# Altium project Microphone_Module.PrjPcb
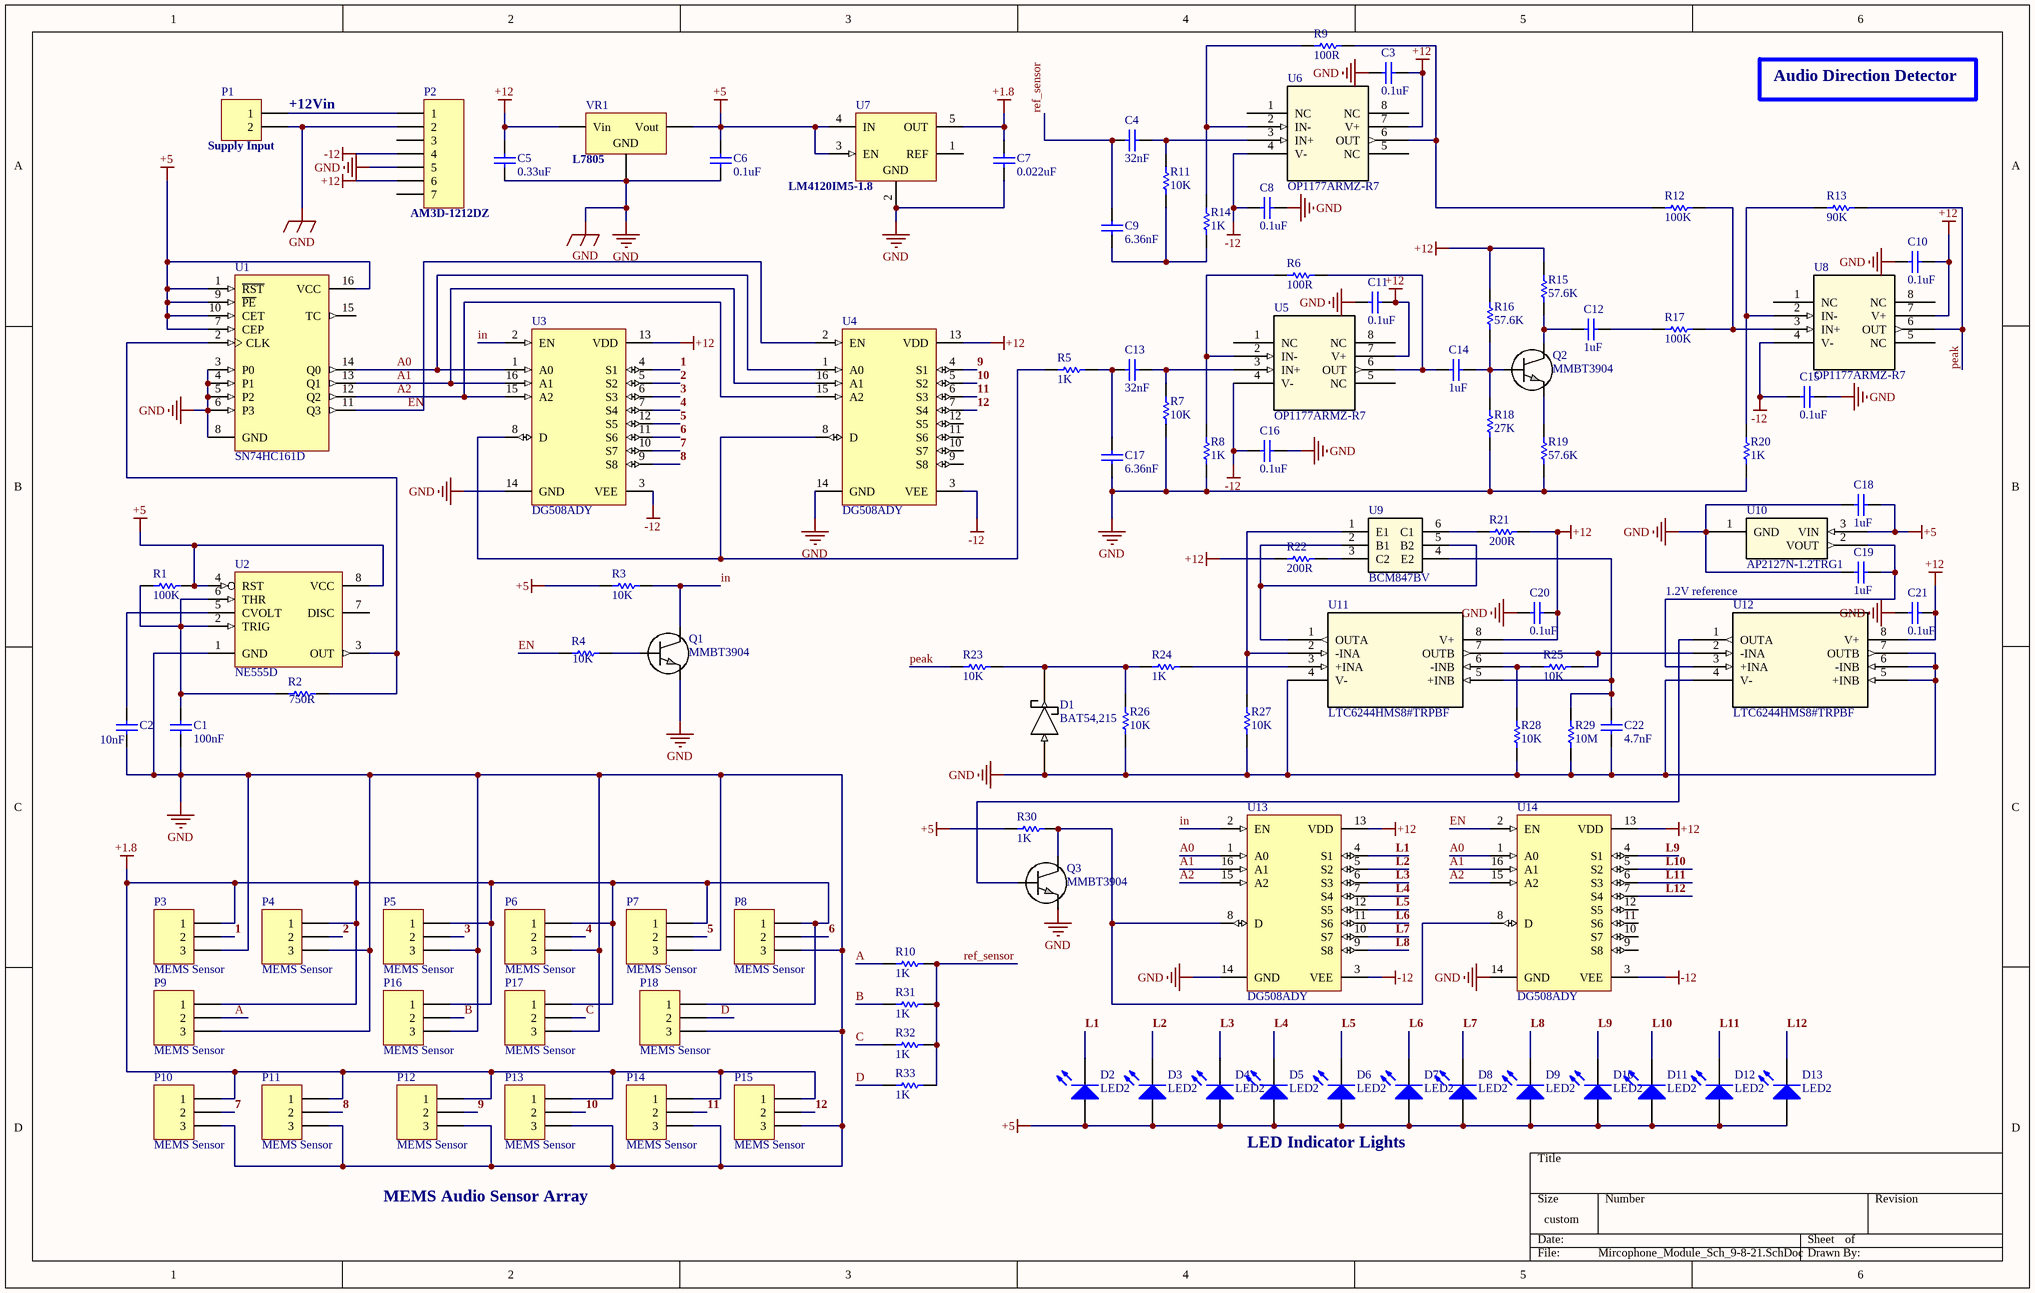
[diagram p0: Mircophone_Module_Sch_9-8-21.SchDoc]
1 sheet, 104 parts. Net scope: global (net labels, ports and power ports of the same name join across sheets).
Board file: Microphone_Module_PCB_14-8-21.PcbDoc

## Sheet Mircophone_Module_Sch_9-8-21.SchDoc
size 381 x 241 mm

### Parts
C1  100nF  [C1206]
C2  10nF  [C1206]
C3  0.1uF  [C1206]
C4  32nF  [C1206]
C5  0.33uF  [C1206]
C6  0.1uF  [C1206]
C7  0.022uF  [C1206]
C8  0.1uF  [C1206]
C9  6.36nF  [C1206]
C10  0.1uF  [C1206]
C11  0.1uF  [C1206]
C12  1uF  [C1206]
C13  32nF  [C1206]
C14  1uF  [C1206]
C15  0.1uF  [C1206]
C16  0.1uF  [C1206]
C17  6.36nF  [C1206]
C18  1uF  [C1206]
C19  1uF  [C1206]
C20  0.1uF  [C1206]
C21  0.1uF  [C1206]
C22  4.7nF  [C1206]
D1  BAT54,215  [SOT95P230X110-3N]
D2  LED2  [0603]
D3  LED2  [0603]
D4  LED2  [0603]
D5  LED2  [0603]
D6  LED2  [0603]
D7  LED2  [0603]
D8  LED2  [0603]
D9  LED2  [0603]
D10  LED2  [0603]
D11  LED2  [0603]
D12  LED2  [0603]
D13  LED2  [0603]
P1  Supply Input  [HDR1X2]
P2  AM3D-1212DZ  [HDR1X7]
P3  MEMS Sensor  [MIC_ICS-43434]
P4  MEMS Sensor  [MIC_ICS-43434]
P5  MEMS Sensor  [MIC_ICS-43434]
P6  MEMS Sensor  [MIC_ICS-43434]
P7  MEMS Sensor  [MIC_ICS-43434]
P8  MEMS Sensor  [MIC_ICS-43434]
P9  MEMS Sensor  [MIC_ICS-43434]
P10  MEMS Sensor  [MIC_ICS-43434]
P11  MEMS Sensor  [MIC_ICS-43434]
P12  MEMS Sensor  [MIC_ICS-43434]
P13  MEMS Sensor  [MIC_ICS-43434]
P14  MEMS Sensor  [MIC_ICS-43434]
P15  MEMS Sensor  [MIC_ICS-43434]
P16  MEMS Sensor  [MIC_ICS-43434]
P17  MEMS Sensor  [MIC_ICS-43434]
P18  MEMS Sensor  [MIC_ICS-43434]
Q1  MMBT3904  [SOT95P230X110-3N]
Q2  MMBT3904  [SOT95P230X110-3N]
Q3  MMBT3904  [SOT95P230X110-3N]
R1  100K  [6-0805_N]
R2  750R  [6-0805_N]
R3  10K  [6-0805_N]
R4  10K  [6-0805_N]
R5  1K  [6-0805_N]
R6  100R  [6-0805_N]
R7  10K  [6-0805_N]
R8  1K  [6-0805_N]
R9  100R  [6-0805_N]
R10  1K  [6-0805_N]
R11  10K  [6-0805_N]
R12  100K  [6-0805_N]
R13  90K  [6-0805_N]
R14  1K  [6-0805_N]
R15  57.6K  [6-0805_N]
R16  57.6K  [6-0805_N]
R17  100K  [6-0805_N]
R18  27K  [6-0805_N]
R19  57.6K  [6-0805_N]
R20  1K  [6-0805_N]
R21  200R  [6-0805_N]
R22  200R  [6-0805_N]
R23  10K  [6-0805_N]
R24  1K  [6-0805_N]
R25  10K  [6-0805_N]
R26  10K  [6-0805_N]
R27  10K  [6-0805_N]
R28  10K  [6-0805_N]
R29  10M  [6-0805_N]
R30  1K  [6-0805_N]
R31  1K  [6-0805_N]
R32  1K  [6-0805_N]
R33  1K  [6-0805_N]
U1  SN74HC161D  [SOIC127P600X175-16N]
U2  NE555D  [SOIC127P599X175-8N]
U3  DG508ADY  [SOIC127P600X175-16N]
U4  DG508ADY  [SOIC127P600X175-16N]
U5  OP1177ARMZ-R7  [SOP65P490X110-8N]
U6  OP1177ARMZ-R7  [SOP65P490X110-8N]
U7  LM4120IM5-1.8  [SOT95P285X120-5N]
U8  OP1177ARMZ-R7  [SOP65P490X110-8N]
U9  BCM847BV  [SOT50P160X60-6N]
U10  AP2127N-1.2TRG1  [SOT91P240X110-3N]
U11  LTC6244HMS8#TRPBF  [MSOP-8_MS]
U12  LTC6244HMS8#TRPBF  [MSOP-8_MS]
U13  DG508ADY  [SOIC127P600X175-16N]
U14  DG508ADY  [SOIC127P600X175-16N]
VR1  L7805  [D2PAK_N]

### Nets
+1.8: C7.2 P3.1 P4.1 P5.1 P6.1 P7.1 P8.1 P9.1 P10.1 P11.1 P12.1 P13.1 P14.1 P15.1 P16.1 P17.1 P18.1 U7.5(OUT)
+5: C6.2 C18.2 D2.1(A) D3.1(A) D4.1(A) D5.1(A) D6.1(A) D7.1(A) D8.1(A) D9.1(A) D10.1(A) D11.1(A) D12.1(A) D13.1(A) R1.2 R3.2 R30.1 U1.1(~{RST}) U1.7(CEP) U1.9(~{PE}) U1.10(CET) U1.16(VCC) U2.4(RST) U2.8(VCC) U7.3(EN) U7.4(IN) U10.3(VIN) VR1.3(Vout)
+12: C3.2 C5.2 C10.2 C11.2 C20.1 C21.1 P2.6 R15.1 R16.1 R21.2 R22.1 U3.13(VDD) U4.13(VDD) U5.7(V+) U6.7(V+) U8.7(V+) U11.8(V+) U12.8(V+) U13.13(VDD) U14.13(VDD) VR1.1(Vin)
-12: C8.2 C15.1 C16.2 P2.4 U3.3(VEE) U4.3(VEE) U5.4(V-) U6.4(V-) U8.4(V-) U13.3(VEE) U14.3(VEE)
GND: C1.1 C2.1 C3.1 C5.1 C6.1 C7.1 C8.1 C10.1 C11.1 C15.2 C16.1 C17.1 C18.1 C19.1 C20.2 C21.2 C22.2 D1.1(ANODE) P1.2 P2.2 P2.5 P3.3 P4.3 P5.3 P6.3 P7.3 P8.3 P9.3 P10.3 P11.3 P12.3 P13.3 P14.3 P15.3 P16.3 P17.3 P18.3 Q1.2 Q3.2 R7.2 R8.2 R18.2 R19.2 R20.2 R26.1 R27.1 R28.2 R29.2 U1.3(P0) U1.4(P1) U1.5(P2) U1.6(P3) U1.8(GND) U2.1(GND) U3.14(GND) U4.14(GND) U7.2(GND) U10.1(GND) U11.4(V-) U12.4(V-) U12.5(+INB) U12.6(-INB) U12.7(OUTB) U13.14(GND) U14.14(GND) VR1.2(GND)
1: P3.2 U3.4(S1)
2: P4.2 U3.5(S2)
3: P5.2 U3.6(S3)
4: P6.2 U3.7(S4)
5: P7.2 U3.12(S5)
6: P8.2 U3.11(S6)
7: P10.2 U3.10(S7)
8: P11.2 U3.9(S8)
9: P12.2 U4.4(S1)
10: P13.2 U4.5(S2)
11: P14.2 U4.6(S3)
12: P15.2 U4.7(S4)
A: P9.2 R10.1
A0: U1.14(Q0) U3.1(A0) U4.1(A0) U13.1(A0) U14.1(A0)
A1: U1.13(Q1) U3.16(A1) U4.16(A1) U13.16(A1) U14.16(A1)
A2: U1.12(Q2) U3.15(A2) U4.15(A2) U13.15(A2) U14.15(A2)
B: P16.2 R31.1
C: P17.2 R32.1
D: P18.2 R33.1
EN: R4.1 U1.11(Q3) U4.2(EN) U14.2(EN)
in: Q1.3 R3.1 U3.2(EN) U13.2(EN)
L1: D2.2(K) U13.4(S1)
L2: D3.2(K) U13.5(S2)
L3: D4.2(K) U13.6(S3)
L4: D5.2(K) U13.7(S4)
L5: D6.2(K) U13.12(S5)
L6: D7.2(K) U13.11(S6)
L7: D8.2(K) U13.10(S7)
L8: D9.2(K) U13.9(S8)
L9: D10.2(K) U14.4(S1)
L10: D11.2(K) U14.5(S2)
L11: D12.2(K) U14.6(S3)
L12: D13.2(K) U14.7(S4)
peak: R13.1 R23.1 U8.6(OUT)
ref_sensor: C4.2 C9.2 R10.2 R31.2 R32.2 R33.2
NetC1_2: C1.2 R1.1 R2.1 U2.2(TRIG) U2.6(THR)
NetC2_2: C2.2 U2.5(CVOLT)
NetC4_1: C4.1 R11.1 U6.3(IN+)
NetC9_1: C9.1 R11.2 R14.2
NetC12_1: C12.1 R17.1
NetC12_2: C12.2 Q2.3 R15.2
NetC13_1: C13.1 R7.1 U5.3(IN+)
NetC13_2: C13.2 C17.2 R5.1
NetC14_1: C14.1 Q2.1 R16.2 R18.1
NetC14_2: C14.2 R6.1 U5.6(OUT)
NetC19_2: C19.2 U10.2(VOUT) U12.3(+INA)
NetC22_1: C22.1 R29.1 U9.4(E2) U11.5(+INB)
NetD1_3: D1.3(CATHODE) R23.2 R24.1 R26.2
NetP1_1: P1.1 P2.1
NetQ1_1: Q1.1 R4.2
NetQ2_2: Q2.2 R19.1
NetQ3_1: Q3.1 U12.1(OUTA)
NetQ3_3: Q3.3 R30.2 U13.8(D) U14.8(D)
NetR2_2: R2.2 U1.2(CLK) U2.3(OUT)
NetR5_2: R5.2 U3.8(D) U4.8(D)
NetR6_2: R6.2 R8.1 U5.2(IN-)
NetR9_1: R9.1 R12.1 U6.6(OUT)
NetR9_2: R9.2 R14.1 U6.2(IN-)
NetR12_2: R12.2 R17.2 U8.3(IN+)
NetR13_2: R13.2 R20.1 U8.2(IN-)
NetR21_1: R21.1 U9.6(C1)
NetR22_2: R22.2 U9.3(C2)
NetR24_2: R24.2 U11.3(+INA)
NetR25_1: R25.1 U11.7(OUTB) U12.2(-INA)
NetR25_2: R25.2 R28.1 U11.6(-INB)
NetR27_2: R27.2 U9.1(E1) U11.2(-INA)
NetU9_2: U9.2(B1) U9.5(B2) U11.1(OUTA)

Not connected (* = marked no-connect by the designer): P2 3 7; U1 15(TC); U2 7(DISC); U4 9(S8) 10(S7) 11(S6) 12(S5); U5 1(NC) 5(NC) 8(NC); U6 1(NC) 5(NC) 8(NC); U7 1(REF); U8 1(NC) 5(NC) 8(NC); U14 9(S8) 10(S7) 11(S6) 12(S5)

### Notes on the sheet
- Audio Direction Detector
- (near P1) +12Vin
- 1.2V reference
- LED Indicator Lights
- MEMS Audio Sensor Array

### Library data of the parts
C1 C3-C6 C8-C11 C13 C15-C17 C20-C22 = Cap Semi: Published: 8-Jun-2000; LatestRevisionDate: 29-May-2009; LatestRevisionNote: IPC-7351 Footprint Added.; PackageReference: C1206; Publisher: Altium Limited; PackageDescription: Chip Capacitor
  C1: Value: 100nF
  C3 C6 C8 C10 C11 C15 C16 C20 C21: Value: 0.1uF
  C4 C13: Value: 32nF
  C5: Value: 0.33uF
  C9 C17: Value: 6.36nF
  C22: Value: 4.7nF
C2 = Cap Semi: Value: 100nF; Published: 8-Jun-2000; LatestRevisionDate: 29-May-2009; LatestRevisionNote: IPC-7351 Footprint Added.; PackageReference: C1206; Publisher: Altium Limited; PackageDescription: Chip Capacitor
C7 = Cap Semi: Value: 0.1uF; Published: 8-Jun-2000; LatestRevisionDate: 29-May-2009; LatestRevisionNote: IPC-7351 Footprint Added.; PackageReference: C1206; Publisher: Altium Limited; PackageDescription: Chip Capacitor
C12 C14 C18 C19 = Cap Semi: Value: 32nF; Published: 8-Jun-2000; LatestRevisionDate: 29-May-2009; LatestRevisionNote: IPC-7351 Footprint Added.; PackageReference: C1206; Publisher: Altium Limited; PackageDescription: Chip Capacitor
D1 = BAT54,215: No Description Available; Mfr_Name: Nexperia; Type: DEV; Copyright: Copyright (C) 2021 Ultra Librarian. All rights reserved.; Manufacturer_Part_Number: BAT54,215; RefDes: RefDes
D2-D13 = LED2: Typical RED, GREEN, YELLOW, AMBER GaAs LED; Published: 8-Jun-2000; LatestRevisionDate: 17-Jul-2002; LatestRevisionNote: Re-released for DXP Platform.; PackageVersion: Feb-2002; PackageReference: 3.2X1.6X1.1; Publisher: Altium Limited; PackageDescription: SM LED; 2 Flat Leads
P1 = Header 2: Header, 2-Pin; LatestRevisionDate: 17-Jul-2002; LatestRevisionNote: Re-released for DXP Platform.; Publisher: Altium Limited
P2 = Header 7: 3 Watt | DC-DC Converter Dual 1000VDC isolation; LatestRevisionDate: 17-Jul-2002; LatestRevisionNote: Re-released for DXP Platform.; Publisher: Altium Limited
P3-P18 = Header 3: MMICT4076-00-908; LatestRevisionDate: 17-Jul-2002; LatestRevisionNote: Re-released for DXP Platform.; Publisher: Altium Limited
Q1-Q3 = MMBT3904: No Description Available; Mfr_Name: Nexperia; Type: DEV; Copyright: Copyright (C) 2021 Ultra Librarian. All rights reserved.; Manufacturer_Part_Number: MMBT3904; RefDes: RefDes
R1-R33 = Res1: Resistor; Published: 8-Jun-2000; LatestRevisionDate: 17-Jul-2002; LatestRevisionNote: Re-released for DXP Platform.; PackageReference: 0805; Publisher: Altium Limited; PackageDescription: 0805
  R1 R12 R17: Value: 100K
  R2: Value: 750R
  R3 R4 R7 R11 R23 R25-R28: Value: 10K
  R5 R8 R10 R14 R20 R24 R30-R33: Value: 1K
  R6 R9: Value: 100R
  R13: Value: 90K
  R15 R16 R19: Value: 57.6K
  R18: Value: 27K
  R21 R22: Value: 200R
  R29: Value: 10M
U1 = SN74HC161D: 4-Bit Synchronous Binary Counter; Published: 8-Jun-2000; LatestRevisionDate: 13-Apr-2006; LatestRevisionNote: IPC-7351 Footprint Added.; DatasheetVersion: May-1997; PackageVersion: Jan-1998; PackageReference: D016; Publisher: Altium Limited; PackageDescription: 16-Pin Small Outline Integrated Circuit 1.27 mm Pitch; Code_IPC: SOIC127P600-16; ComponentLink1Description: Manufacturer Link; ComponentLink1URL: http://www.ti.com/; ComponentLink2Description: Datasheet; ComponentLink2URL: http://www-s.ti.com/sc/ds/sn74hc161.pdf
U2 = NE555D: General-Purpose Single Bipolar Timer; Published: 24-Aug-2001; LatestRevisionDate: 13-Apr-2006; LatestRevisionNote: IPC-7351 Footprint Added.; DatasheetVersion: Jul-1998; PackageVersion: Dec-2002; PackageReference: SO8; Publisher: Altium Limited; PackageDescription: 8-Pin Small Outline Integrated Circuit 1.27 mm Pitch; Code_JEDEC: MS-012-AA; Code_IPC: SOIC127P600-8; ComponentLink1Description: Manufacturer Link; ComponentLink1URL: http://www.st.com/; ComponentLink2Description: Datasheet; ComponentLink2URL: http://www.st.com/stonline/products/literature/ds/2182/ne555.pdf
U3 U4 U13 U14 = DG508ADY: Monolithic CMOS Analog Multiplexer; Published: 16-Jan-2001; LatestRevisionDate: 13-Apr-2006; LatestRevisionNote: IPC-7351 Footprint Added.; DatasheetVersion: Feb-1996; PackageReference: NSO16; Publisher: Altium Limited; PackageDescription: 16-Pin Small Outline Integrated Circuit 1.27 mm Pitch; Code_JEDEC: MS-012-AC; Code_IPC: SOIC127P600-16; ComponentLink1Description: Manufacturer Link; ComponentLink1URL: http://www.maxim-ic.com/; ComponentLink2Description: Datasheet; ComponentLink2URL: http://pdfserv.maxim-ic.com/en/ds/DG508A-DG509A.pdf
U5 U6 U8 = OP1177ARMZ-R7: No Description Available; Mfr_Name: Analog Devices Inc; Copyright: Copyright (C) 2021 Ultra Librarian. All rights reserved.; Manufacturer_Part_Number: OP1177ARMZ-R7; Digi-Key_Part_Number_1: OP1177ARMZ-R7CT-ND; Digi-Key_Part_Number_2: OP1177ARMZ-R7DKR-ND; Digi-Key_Part_Number_3: OP1177ARMZ-R7TR-ND; RefDes: RefDes; Type: DEV
U7 = LM4120IM5-1.8: Precision Micropower Low Dropout Voltage Reference, 5-pin SOT-23; Manufacturer: National Semiconductor; PackageTopMarking: R21B*XTT; PowerWise: Y; CompType: Voltage Reference IC; Published: 4-Dec-2008; DatasheetVersion: Mar-2005; PackageVersion: revD, Aug-2008; PackageReference: MF05A; Publisher: Altium Limited; PackageDescription: Molded SOT-23, .115 x .063 x .040 in Body, 5 Lead, .0375 in Pitch; Supplier 1: Farnell; Supplier Part Number 1: 1312740; PartNumber: LM4120IM5-1.8; RoHS: N; PinCount: 5; ComponentLink1Description: LM4120 Datasheet; ComponentLink1URL: http://www.national.com/ds/LM/LM4120.pdf; ComponentLink2Description: LM4120 Web Page; ComponentLink2URL: http://www.national.com/pf/LM/LM4120.html; ComponentLink3Description: MF05A Package Page; ComponentLink3URL: http://www.national.com/packaging/folders/mf05a.html
U9 = BCM847BV: No Description Available; Mfr_Name: Nexperia; Copyright: Copyright (C) 2021 Ultra Librarian. All rights reserved.; Manufacturer_Part_Number: BCM847BV; RefDes: RefDes; Type: DEV
U10 = AP2127N-1.8TRG1: No Description Available; Mfr_Name: Diodes Inc; Copyright: Copyright (C) 2021 Ultra Librarian. All rights reserved.; Manufacturer_Part_Number: AP2127N-1.8TRG1; RefDes: RefDes; Type: DEV
U11 U12 = LTC6244HMS8#TRPBF: No Description Available; Mfr_Name: Analog Devices / Linear Technology; Copyright: Copyright (C) 2021 Ultra Librarian. All rights reserved.; Manufacturer_Part_Number: LTC6244HMS8#TRPBF; Digi-Key_Part_Number_1: LTC6244HMS8#TRPBFCT-ND; Digi-Key_Part_Number_2: LTC6244HMS8#TRPBFDKR-ND; Digi-Key_Part_Number_3: LTC6244HMS8#TRPBFTR-ND; RefDes: RefDes; Type: DEV
VR1 = Volt Reg: Voltage Regulator; Published: 24-Mar-1999; LatestRevisionDate: 29-May-2009; LatestRevisionNote: IPC-7351 Footprint Added.; PackageReference: D2PAK; Publisher: Altium Limited; PackageDescription: 3-Pin Transistor Outline Package 2.54 mm Pitch, 15.1 mm Lead Span